# Altium schematic sheet Power12V.SchDoc
size 359 x 172 mm; SheetNumber: 1; SheetTotal: 1
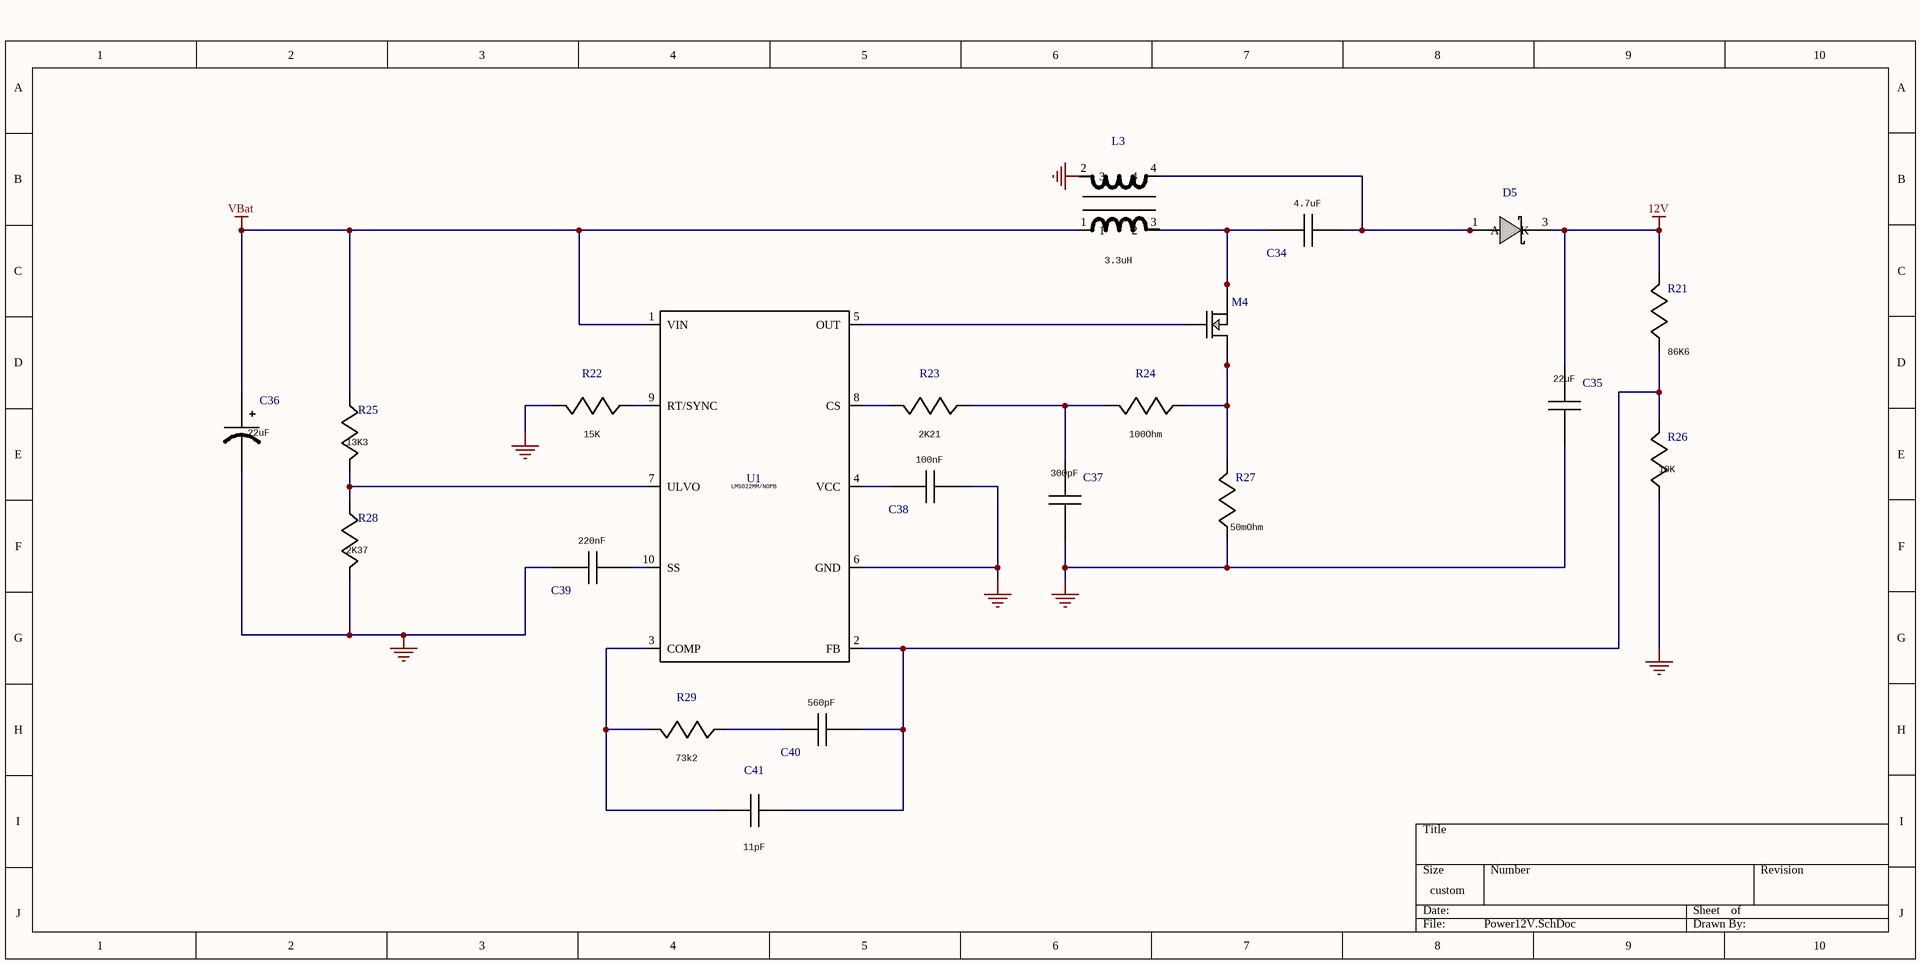
[diagram p0: Power12V.SchDoc]

## Parts
C34  value 4.7uF  [0805]  (hidden comment: GRM21BR61E475MA1)
C35  value 22uF  [1210]  (hidden comment: GRM32ER61C226KE2)
C36  value 22uF  [3528-21]  (hidden comment: TPSB226K020R0400)
C37  value 300pF  [1608]  (hidden comment: GRM1555C1E301JA0)
C38  value 100nF  [1608]  (hidden comment: GRM155R61C104KA8)
C39  value 220nF  [1608]  (hidden comment: GRM155R71C224KA1)
C40  value 560pF  [1608]  (hidden comment: CC0805KRX7R9BB56)
C41  value 11pF  [1608]  (hidden comment: C0603C0G1E110G)
D5  PDS760-13  [PowerDI5]  (value not drawn)
L3  value 3.3uH  [DRQ127]  (hidden comment: DRQ127-3R3-R)
M4  CSD16340Q3  [TRANS_NexFET_Q3]  (value not drawn)
R21  value 86K6  [1608]  (hidden comment: CRCW040286K6FKED)
R22  value 15K  [1608]  (hidden comment: CRCW040215K0FKED)
R23  value 2K21  [1608]  (hidden comment: CRCW04022K21FKED)
R24  value 100Ohm  [1608]  (hidden comment: CRCW0402100RFKED)
R25  value 13K3  [1608]  (hidden comment: CRCW040213K3FKED)
R26  value 10K  [1608]  (hidden comment: CRCW040210K0FKED)
R27  value 50mOhm  [2010]  (hidden comment: CSRN2010FK50L0)
R28  value 2K37  [1608]  (hidden comment: CRCW04022K37FKED)
R29  value 73k2  [1608]  (hidden comment: CRCW040273K2FKED)
U1  LM5022MM/NOPB  [MUB10A]

## Nets
12V: C35.1 D5.3(K) R21.1
GND: C35.2 C36.2(-) C37.2 C38.2 C39.2 L3.2(3) R22.1 R26.2 R27.2 R28.1 U1.6(GND)
VBat: C36.1(+) L3.1 R25.2 U1.1(VIN)
NetC34_1: C34.1 D5.1(A) D5.2(A) L3.4
NetC34_2: C34.2 L3.3(2) M4.1(Source) M4.2(Source) M4.3(Source)
NetC37_1: C37.1 R23.2 R24.1
NetC38_1: C38.1 U1.4(VCC)
NetC39_1: C39.1 U1.10(SS)
NetC40_1: C40.1 C41.1 R21.2 R26.1 U1.2(FB)
NetC40_2: C40.2 R29.2
NetC41_2: C41.2 R29.1 U1.3(COMP)
NetM4_4: M4.4(Gate) U1.5(OUT)
NetM4_5: M4.5(Drain) M4.6(Drain) M4.7(Drain) M4.8(Drain) M4.9(Drain) R24.2 R27.1
NetR22_2: R22.2 U1.9(RT/SYNC)
NetR23_1: R23.1 U1.8(CS)
NetR25_1: R25.1 R28.2 U1.7(ULVO)

## Library data of the parts
C34 = GRM21BR61E475MA1: Imported; Manufacturer_Part_Number: GRM21BR61E475MA12L; Vendor: MuRata; rn: Csep; Manufacturer_Name: MuRata; RefDes: RefDes; TYPE: TYPE
C35 = GRM32ER61C226KE2: Imported; Manufacturer_Part_Number: GRM32ER61C226KE20L; Vendor: MuRata; rn: Cout; Manufacturer_Name: MuRata; RefDes: RefDes; TYPE: TYPE
C36 = TPSB226K020R0400: Imported; Vendor: AVX; rn: Cin; Manufacturer_Part_Number: TPSB226K020R0400; Manufacturer_Name: AVX; RefDes: RefDes; TYPE: TYPE
C37 = GRM1555C1E301JA0: Imported; Manufacturer_Part_Number: GRM1555C1E301JA01D; Vendor: MuRata; rn: Cramp; Manufacturer_Name: MuRata; RefDes: RefDes; TYPE: TYPE
C38 = GRM155R61C104KA8: Imported; Manufacturer_Part_Number: GRM155R61C104KA88D; Vendor: MuRata; rn: Ccc; Manufacturer_Name: MuRata; RefDes: RefDes; TYPE: TYPE
C39 = GRM155R71C224KA1: Imported; Manufacturer_Part_Number: GRM155R71C224KA12D; Vendor: MuRata; rn: Css; Manufacturer_Name: MuRata; RefDes: RefDes; TYPE: TYPE
C40 = CC0805KRX7R9BB56: Imported; Manufacturer_Part_Number: CC0805KRX7R9BB561; Vendor: Yageo America; rn: Ccomp; Manufacturer_Name: Yageo America; RefDes: RefDes; TYPE: TYPE
C41 = C0603C0G1E110G: Imported; Vendor: TDK; rn: Ccomp2; Manufacturer_Part_Number: C0603C0G1E110G; Manufacturer_Name: TDK; RefDes: RefDes; TYPE: TYPE
D5 = PDS760-13: Imported; Vendor: Diodes Inc.; Value: Value; Manufacturer_Part_Number: PDS760-13; Manufacturer_Name: Diodes Inc.; RefDes: RefDes; TYPE: TYPE
L3 = DRQ127-3R3-R: Imported; Type: SMT; Vendor: Coiltronics; Manufacturer_Part_Number: DRQ127-3R3-R; Manufacturer_Name: Coiltronics; RefDes: RefDes
M4 = CSD16340Q3: Imported; Vendor: Texas Instruments; Value: Value; Manufacturer_Part_Number: CSD16340Q3; Manufacturer_Name: Texas Instruments; RefDes: RefDes; TYPE: TYPE
R21 = CRCW040286K6FKED: Imported; Vendor: Vishay-Dale; rn: Rfb2; Manufacturer_Part_Number: CRCW040286K6FKED; Manufacturer_Name: Vishay-Dale; RefDes: RefDes; TYPE: TYPE
R22 = CRCW040215K0FKED: Imported; Vendor: Vishay-Dale; rn: Rfadj; Manufacturer_Part_Number: CRCW040215K0FKED; Manufacturer_Name: Vishay-Dale; RefDes: RefDes; TYPE: TYPE
R23 = CRCW04022K21FKED: Imported; Vendor: Vishay-Dale; rn: Rramp2; Manufacturer_Part_Number: CRCW04022K21FKED; Manufacturer_Name: Vishay-Dale; RefDes: RefDes; TYPE: TYPE
R24 = CRCW0402100RFKED: Imported; Vendor: Vishay-Dale; rn: Rramp; Manufacturer_Part_Number: CRCW0402100RFKED; Manufacturer_Name: Vishay-Dale; RefDes: RefDes; TYPE: TYPE
R25 = CRCW040213K3FKED: Imported; Vendor: Vishay-Dale; rn: Ruvpt; Manufacturer_Part_Number: CRCW040213K3FKED; Manufacturer_Name: Vishay-Dale; RefDes: RefDes; TYPE: TYPE
R26 = CRCW040210K0FKED: Imported; Vendor: Vishay-Dale; rn: Rfb1; Manufacturer_Part_Number: CRCW040210K0FKED; Manufacturer_Name: Vishay-Dale; RefDes: RefDes; TYPE: TYPE
R27 = CSRN2010FK50L0: Imported; Vendor: Stackpole Electronics Inc; rn: Rsense; Manufacturer_Part_Number: CSRN2010FK50L0; Manufacturer_Name: Stackpole Electronics Inc; RefDes: RefDes; TYPE: TYPE
R28 = CRCW04022K37FKED: Imported; Vendor: Vishay-Dale; rn: Ruvpb; Manufacturer_Part_Number: CRCW04022K37FKED; Manufacturer_Name: Vishay-Dale; RefDes: RefDes; TYPE: TYPE
R29 = CRCW040273K2FKED: Imported; Vendor: Vishay-Dale; rn: Rcomp; Manufacturer_Part_Number: CRCW040273K2FKED; Manufacturer_Name: Vishay-Dale; RefDes: RefDes; TYPE: TYPE
U1 = LM5022MM/NOPB: Imported; Vendor: Texas Instruments; Value: Value; Manufacturer_Part_Number: LM5022MM/NOPB; Manufacturer_Name: Texas Instruments; RefDes: RefDes; TYPE: TYPE